# EAGLE schematic snare_host_brd (EAGLE 9.6.2)
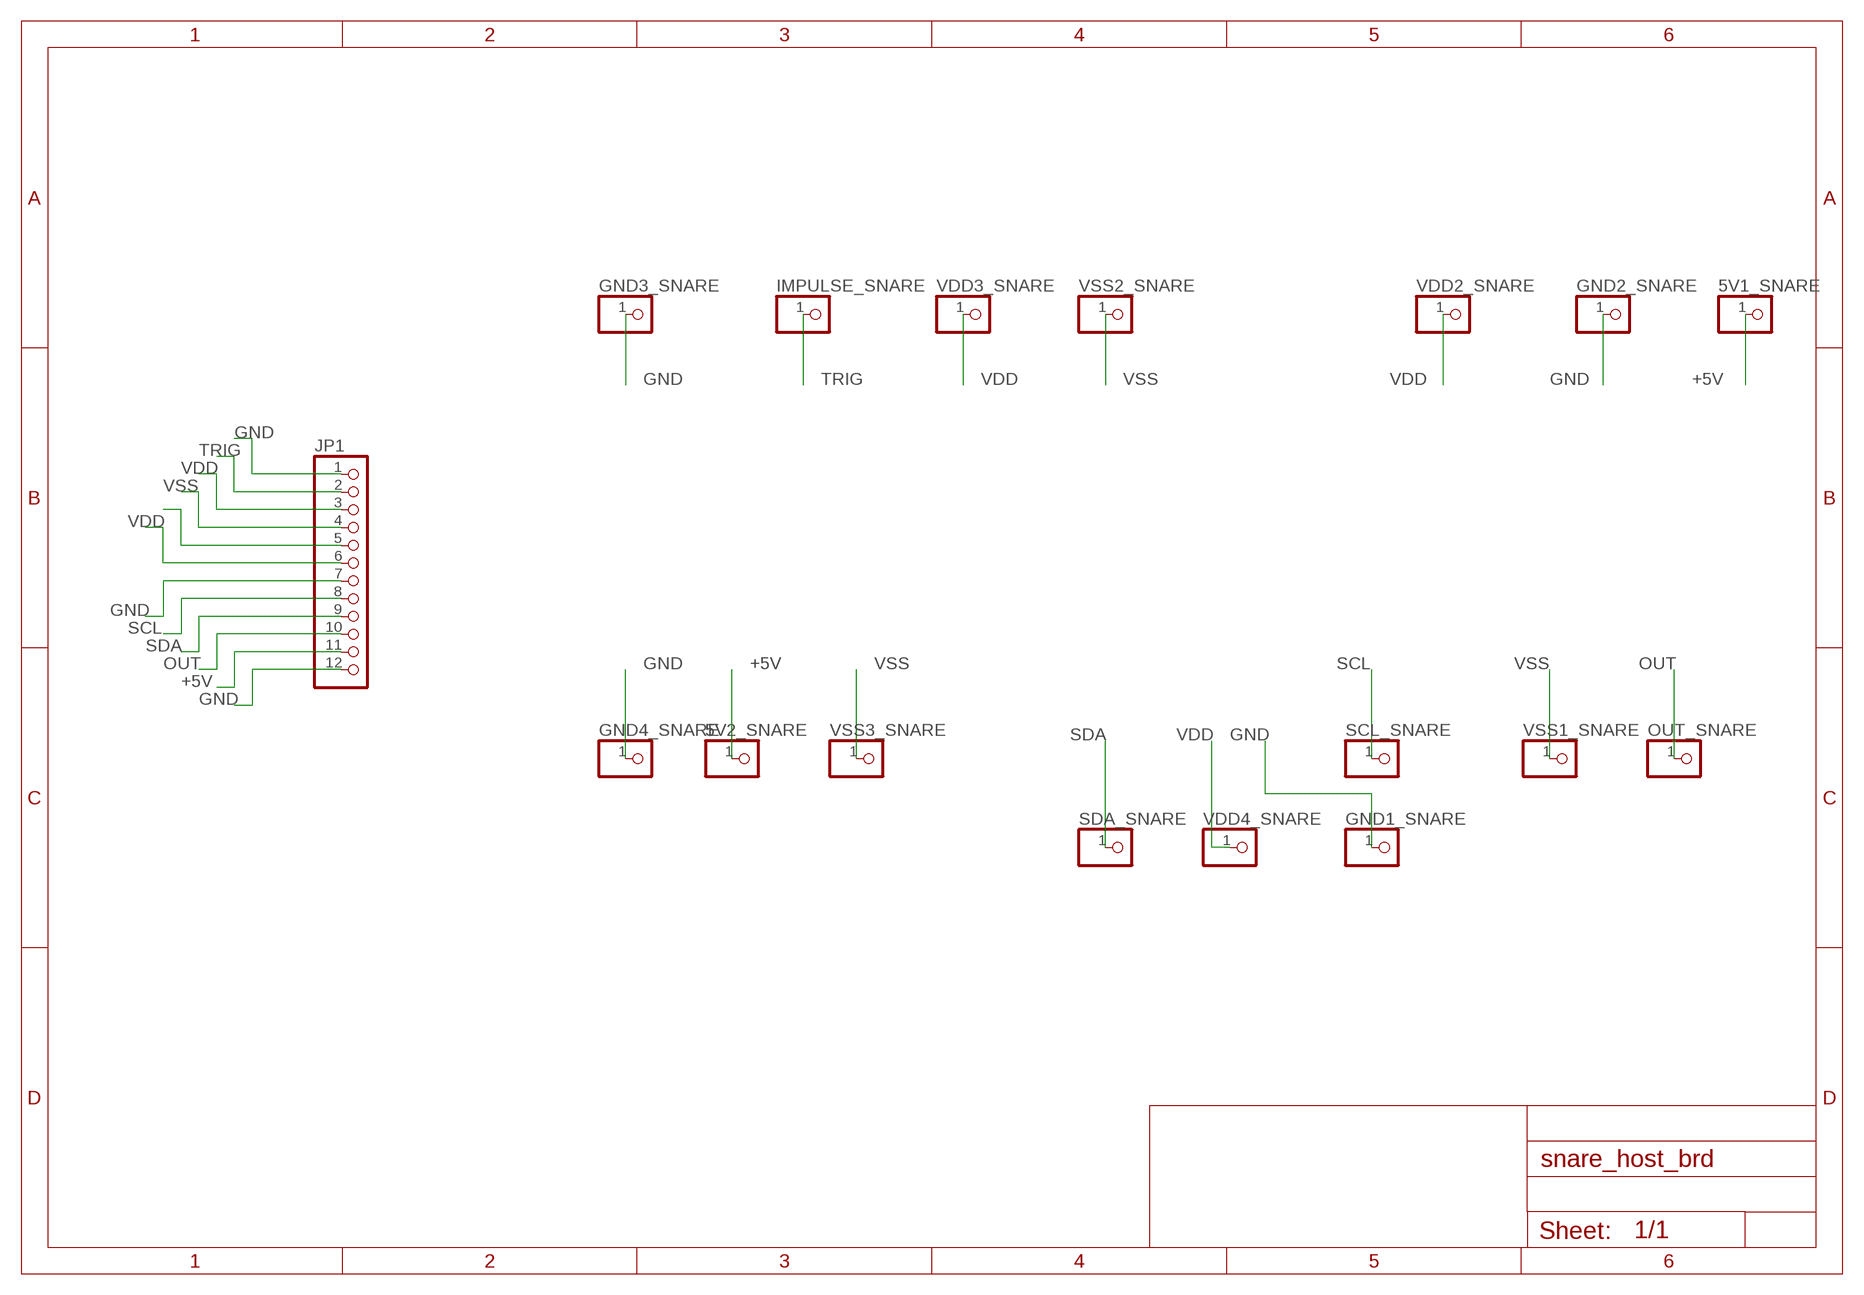
[diagram p0: schematic, sheet 1]

## Parts
5V1_SNARE  PINHD-1X1  [1X01]
5V2_SNARE  PINHD-1X1  [1X01]
GND1_SNARE  PINHD-1X1  [1X01]
GND2_SNARE  PINHD-1X1  [1X01]
GND3_SNARE  PINHD-1X1  [1X01]
GND4_SNARE  PINHD-1X1  [1X01]
IMPULSE_SNARE  PINHD-1X1  [1X01]
JP1  PINHD-1X12/90  [1X12/90]
OUT_SNARE  PINHD-1X1  [1X01]
SCL_SNARE  PINHD-1X1  [1X01]
SDA_SNARE  PINHD-1X1  [1X01]
VDD2_SNARE  PINHD-1X1  [1X01]
VDD3_SNARE  PINHD-1X1  [1X01]
VDD4_SNARE  PINHD-1X1  [1X01]
VSS1_SNARE  PINHD-1X1  [1X01]
VSS2_SNARE  PINHD-1X1  [1X01]
VSS3_SNARE  PINHD-1X1  [1X01]

## Nets
+5V: 5V1_SNARE.1 5V2_SNARE.1 JP1.11
GND: GND1_SNARE.1 GND2_SNARE.1 GND3_SNARE.1 GND4_SNARE.1 JP1.1 JP1.7 JP1.12
N$5: JP1.5
OUT: JP1.10 OUT_SNARE.1
SCL: JP1.8 SCL_SNARE.1
SDA: JP1.9 SDA_SNARE.1
TRIG: IMPULSE_SNARE.1 JP1.2
VDD: JP1.3 JP1.6 VDD2_SNARE.1 VDD3_SNARE.1 VDD4_SNARE.1
VSS: JP1.4 VSS1_SNARE.1 VSS2_SNARE.1 VSS3_SNARE.1

## Library data of the parts
5V1_SNARE 5V2_SNARE GND1_SNARE GND2_SNARE GND3_SNARE GND4_SNARE IMPULSE_SNARE OUT_SNARE SCL_SNARE SDA_SNARE VDD2_SNARE VDD3_SNARE VDD4_SNARE VSS1_SNARE VSS2_SNARE VSS3_SNARE = pinhead:PINHD-1X1: PIN HEADER
JP1 = pinhead:PINHD-1X12: PIN HEADER